# EAGLE schematic Schematic-v1.2 (EAGLE 9.7.0)
DESCRIPTION: Test Description
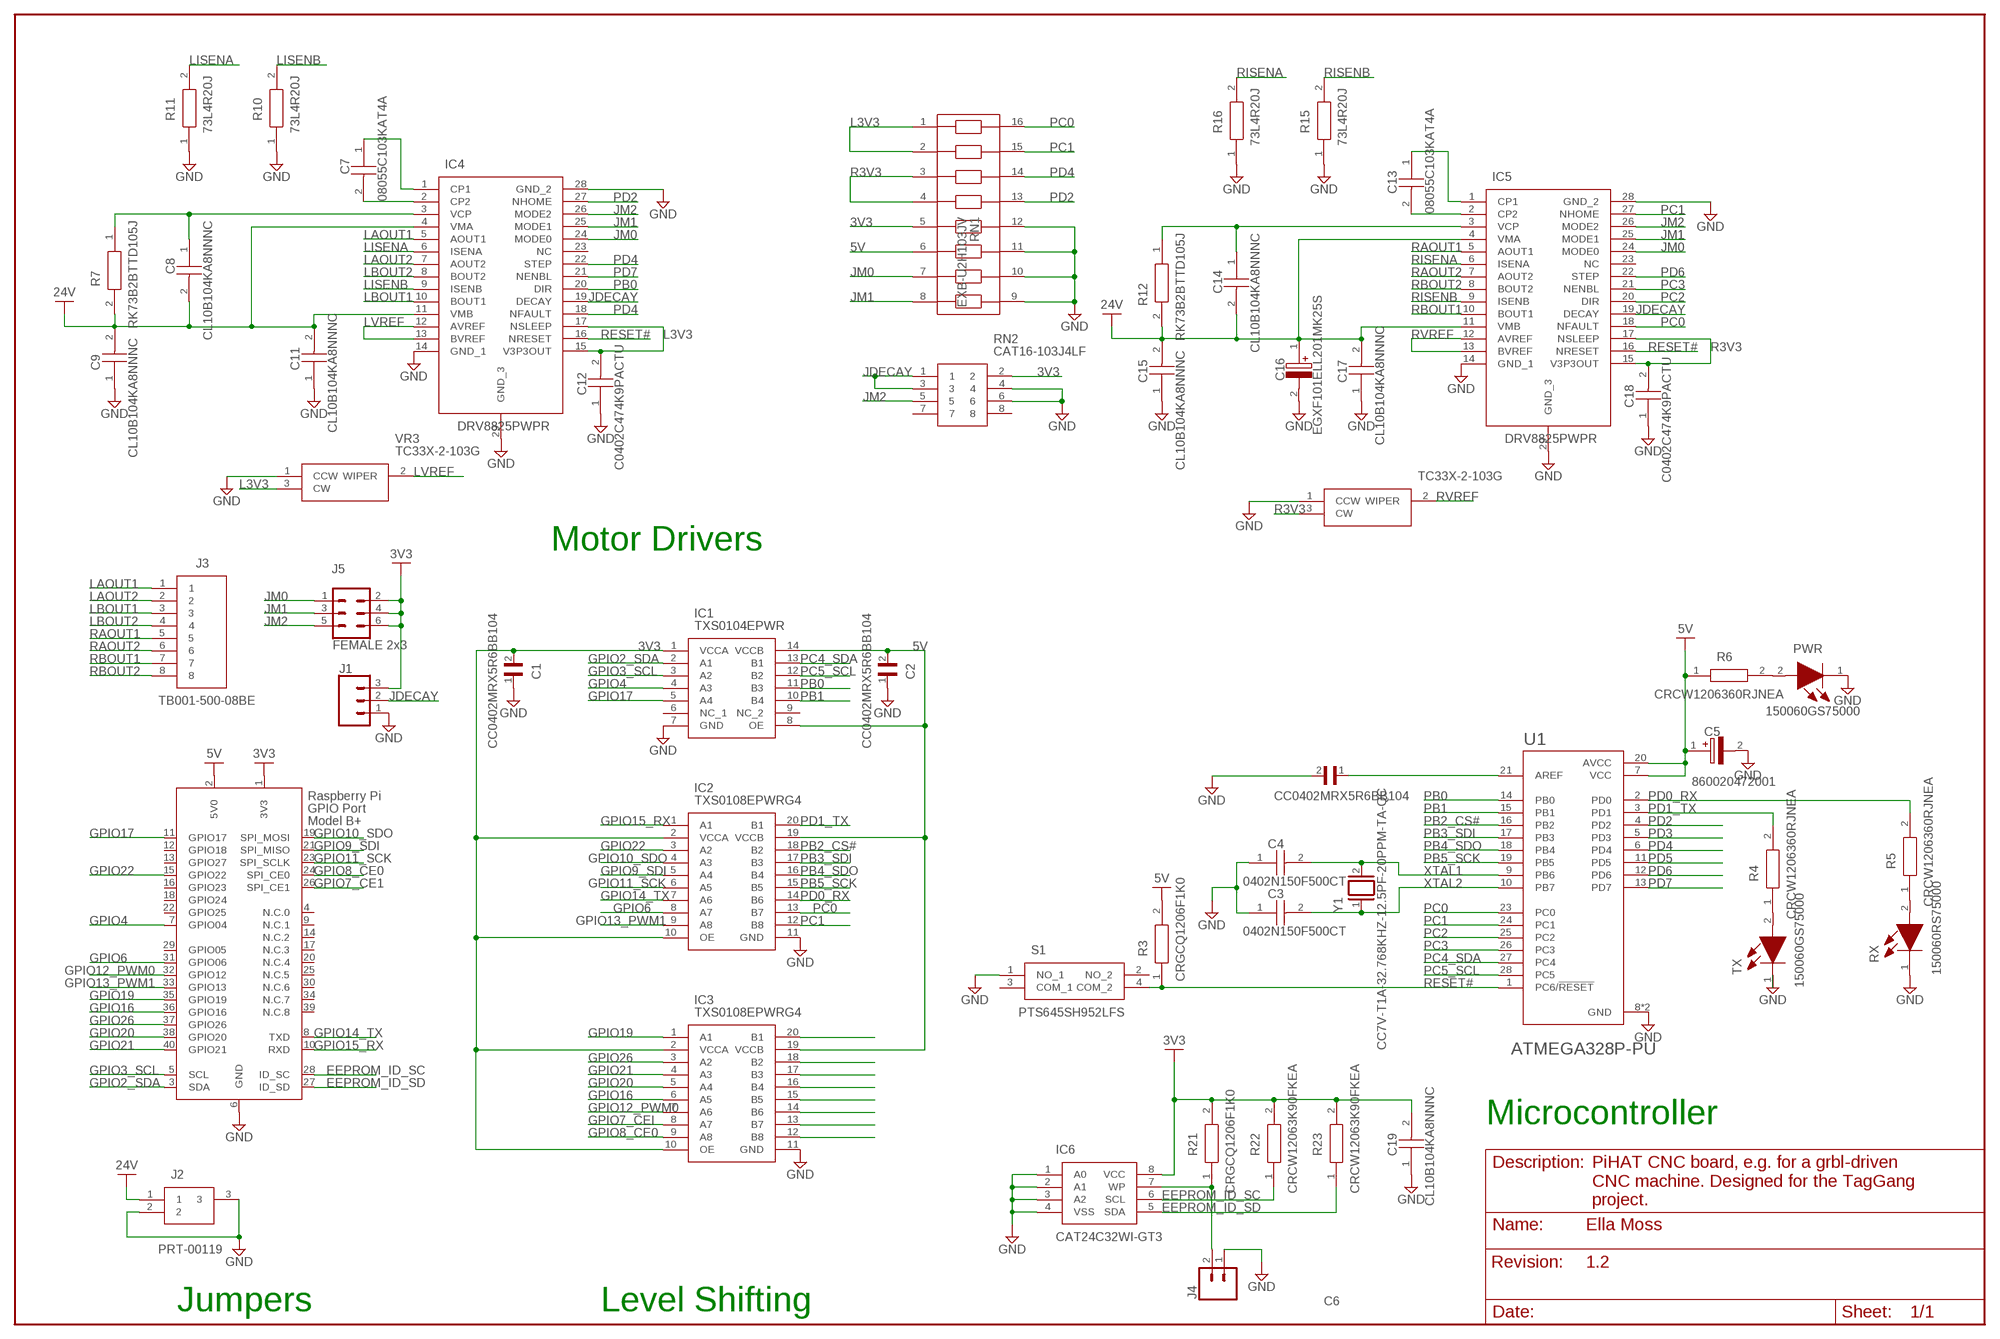
[diagram p0: schematic, sheet 1]

## Parts
C1  CC0402MRX5R6BB104  [CAPC1005X55N]
C2  CC0402MRX5R6BB104  [CAPC1005X55N]
C3  0402N150F500CT  [CAPC1005X55N]
C4  0402N150F500CT  [CAPC1005X55N]
C5  860020472001  [CAPPRD200W52D500H1250]
C6  CC0402MRX5R6BB104  [CAPC1005X55N]
C7  08055C103KAT4A  [CAPC2012X94N]
C8  CL10B104KA8NNNC  [CAPC1608X90N]
C9  CL10B104KA8NNNC  [CAPC1608X90N]
C11  CL10B104KA8NNNC  [CAPC1608X90N]
C12  C0402C474K9PACTU  [CAPC1005X55N]
C13  08055C103KAT4A  [CAPC2012X94N]
C14  CL10B104KA8NNNC  [CAPC1608X90N]
C15  CL10B104KA8NNNC  [CAPC1608X90N]
C16  EGXF101ELL201MK25S  [CAPPRD500W60D1275H2650]
C17  CL10B104KA8NNNC  [CAPC1608X90N]
C18  C0402C474K9PACTU  [CAPC1005X55N]
C19  CL10B104KA8NNNC  [CAPC1608X90N]
IC1  TXS0104EPWR  [SOP65P640X120-14N]
IC2  TXS0108EPWRG4  [SOP65P640X120-20N]
IC3  TXS0108EPWRG4  [SOP65P640X120-20N]
IC4  DRV8825PWPR  [SOP65P640X120-29N]
IC5  DRV8825PWPR  [SOP65P640X120-29N]
IC6  CAT24C32WI-GT3  [SOIC127P600X175-8N]
J1  CONN_03  [1X03]
J2  PRT-00119  [PRT00119]
J3  TB001-500-08BE  [TB00150008BE]
J4  CONN_02  [1X02]
J5  FEMALE 2x3  CONN_03X2FEMALE  [2X3]
PWR  150060GS75000  [LEDC1608X80N]
R3  CRGCQ1206F1K0  [RESC3116X65N]
R4  CRCW1206360RJNEA  [RESC3216X60N]
R5  CRCW1206360RJNEA  [RESC3216X60N]
R6  CRCW1206360RJNEA  [RESC3216X60N]
R7  RK73B2BTTD105J  [RESC3216X70N]
R10  73L4R20J  [RESC3216X70N]
R11  73L4R20J  [RESC3216X70N]
R12  RK73B2BTTD105J  [RESC3216X70N]
R15  73L4R20J  [RESC3216X70N]
R16  73L4R20J  [RESC3216X70N]
R21  CRGCQ1206F1K0  [RESC3116X65N]
R22  CRCW12063K90FKEA  [RESC3216X60N]
R23  CRCW12063K90FKEA  [RESC3216X60N]
RN1  EXB-U2H103JV  [EXBU2H]
RN2  CAT16-103J4LF  [CAPCAV80P155X320X60-8L]
RX  150060RS75000  [LEDC1608X80N]
S1  PTS645SH952LFS  [PTS645SH952LFS]
TX  150060GS75000  [LEDC1608X80N]
U1  ATMEGA328P-PU  [DIP794W46P254L2967H457Q28B]
VR3  TC33X-2-103G  [TC33X2503E]
VR4  TC33X-2-103G  [TC33X2503E]
X1  RASPI_BOARD_B+_HD  [RASPI_BOARD_B+HAT_DF]
Y1  CC7V-T1A-32.768KHZ-12.5PF-20PPM-TA-QC  [XTAL_CC7V-T1A-32.768KHZ-12.5PF-20PPM-TA-QC]

## Nets
3V3: C1.2 C19.2 IC1.1(VCCA) IC2.2(VCCA) IC2.10(OE) IC3.2(VCCA) IC3.10(OE) IC6.8(VCC) J1.3 J5.2 J5.4 J5.6 R21.2 R22.2 R23.2 RN1.5 RN2.2 X1.1(3V3)
5V: C2.2 C5.1(+) IC1.8(OE) IC1.14(VCCB) IC2.19(VCCB) IC3.19(VCCB) R3.2 R6.1 RN1.6 U1.7(VCC) U1.20(AVCC) X1.2(5V0)
24V: C8.2 C9.2 C11.2 C14.2 C15.2 C16.1(+) C17.2 IC4.4(VMA) IC4.11(VMB) IC5.4(VMA) IC5.11(VMB) J2.1 R7.2 R12.2
EEPROM_ID_SC: IC6.6(SCL) R22.1 X1.28(ID_SC)
EEPROM_ID_SD: IC6.5(SDA) R23.1 X1.27(ID_SD)
GND: C1.1 C2.1 C3.1 C4.1 C5.2(-) C6.2 C9.1 C11.1 C12.1 C15.1 C16.2(-) C17.1 C18.1 C19.1 IC1.7(GND) IC2.11(GND) IC3.11(GND) IC4.14(GND_1) IC4.28(GND_2) IC4.29(GND_3) IC5.14(GND_1) IC5.28(GND_2) IC5.29(GND_3) IC6.1(A0) IC6.2(A1) IC6.3(A2) IC6.4(VSS) J1.1 J2.2 J2.3 J4.1 PWR.1(K) R10.1 R11.1 R15.1 R16.1 RN1.9 RN1.10 RN1.11 RN1.12 RN2.4 RN2.6 RX.1(K) S1.1(NO_1) TX.1(K) U1.8(GND) U1.22(GND) VR3.1(CCW) VR4.1(CCW) X1.6(GND)
GPIO2_SDA: IC1.2(A1) X1.3(SDA)
GPIO3_SCL: IC1.3(A2) X1.5(SCL)
GPIO4: IC1.4(A3) X1.7(GPIO04)
GPIO6: IC2.8(A7) X1.31(GPIO06)
GPIO7_CE1: X1.26(SPI_CE1)
GPIO7_CEI: IC3.8(A7)
GPIO8_CE0: IC3.9(A8) X1.24(SPI_CE0)
GPIO9_SDI: IC2.5(A4) X1.21(SPI_MISO)
GPIO10_SDO: IC2.4(A3) X1.19(SPI_MOSI)
GPIO11_SCK: IC2.6(A5) X1.23(SPI_SCLK)
GPIO12_PWM0: IC3.7(A6) X1.32(GPIO12)
GPIO13_PWM1: IC2.9(A8) X1.33(GPIO13)
GPIO14_TX: IC2.7(A6) X1.8(TXD)
GPIO15_RX: IC2.1(A1) X1.10(RXD)
GPIO16: IC3.6(A5) X1.36(GPIO16)
GPIO17: IC1.5(A4) X1.11(GPIO17)
GPIO19: IC3.1(A1) X1.35(GPIO19)
GPIO20: IC3.5(A4) X1.38(GPIO20)
GPIO21: IC3.4(A3) X1.40(GPIO21)
GPIO22: IC2.3(A2) X1.15(GPIO22)
GPIO26: IC3.3(A2) X1.37(GPIO26)
JDECAY: IC4.19(DECAY) IC5.19(DECAY) J1.2 RN2.1 RN2.3
JM0: IC4.24(MODE0) IC5.24(MODE0) J5.1 RN1.7
JM1: IC4.25(MODE1) IC5.25(MODE1) J5.3 RN1.8
JM2: IC4.26(MODE2) IC5.26(MODE2) J5.5 RN2.5
L3V3: C12.2 IC4.15(V3P3OUT) IC4.17(NSLEEP) RN1.1 RN1.2 VR3.3(CW)
LAOUT1: IC4.5(AOUT1) J3.1
LAOUT2: IC4.7(AOUT2) J3.2
LBOUT1: IC4.10(BOUT1) J3.3
LBOUT2: IC4.8(BOUT2) J3.4
LISENA: IC4.6(ISENA) R11.2
LISENB: IC4.9(ISENB) R10.2
LVREF: IC4.12(AVREF) IC4.13(BVREF) VR3.2(WIPER)
N$1: C13.1 IC5.1(CP1)
N$2: R5.1 RX.2(A)
N$3: PWR.2(A) R6.2
N$4: C6.1 U1.21(AREF)
N$5: C7.1 IC4.1(CP1)
N$6: C7.2 IC4.2(CP2)
N$7: C13.2 IC5.2(CP2)
N$8: C8.1 IC4.3(VCP) R7.1
N$9: C14.1 IC5.3(VCP) R12.1
N$10: R4.1 TX.2(A)
N$11: IC6.7(WP) J4.2 R21.1
N$12: IC3.12(B8)
N$13: IC3.13(B7)
N$14: IC3.14(B6)
N$15: IC3.15(B5)
N$16: IC3.16(B4)
N$17: IC3.17(B3)
N$18: IC3.18(B2)
N$19: IC3.20(B1)
PB0: IC1.11(B3) IC4.20(DIR) U1.14(PB0)
PB1: IC1.10(B4) U1.15(PB1)
PB2_CS#: IC2.18(B2) U1.16(PB2)
PB3_SDI: IC2.17(B3) U1.17(PB3)
PB4_SDO: IC2.16(B4) U1.18(PB4)
PB5_SCK: IC2.15(B5) U1.19(PB5)
PC0: IC2.13(B7) IC5.18(NFAULT) RN1.16 U1.23(PC0)
PC1: IC2.12(B8) IC5.27(NHOME) RN1.15 U1.24(PC1)
PC2: IC5.20(DIR) U1.25(PC2)
PC3: IC5.21(NENBL) U1.26(PC3)
PC4_SDA: IC1.13(B1) U1.27(PC4)
PC5_SCL: IC1.12(B2) U1.28(PC5)
PD0_RX: IC2.14(B6) R5.2 U1.2(PD0)
PD1_TX: IC2.20(B1) R4.2 U1.3(PD1)
PD2: IC4.27(NHOME) RN1.13 U1.4(PD2)
PD3: U1.5(PD3)
PD4: IC4.18(NFAULT) IC4.22(STEP) RN1.14 U1.6(PD4)
PD5: U1.11(PD5)
PD6: IC5.22(STEP) U1.12(PD6)
PD7: IC4.21(NENBL) U1.13(PD7)
R3V3: C18.2 IC5.15(V3P3OUT) IC5.17(NSLEEP) RN1.3 RN1.4 VR4.3(CW)
RAOUT1: IC5.5(AOUT1) J3.5
RAOUT2: IC5.7(AOUT2) J3.6
RBOUT1: IC5.10(BOUT1) J3.7
RBOUT2: IC5.8(BOUT2) J3.8
RESET#: IC4.16(NRESET) IC5.16(NRESET) R3.1 S1.4(COM_2) U1.1(PC6/!RESET)
RISENA: IC5.6(ISENA) R16.2
RISENB: IC5.9(ISENB) R15.2
RVREF: IC5.12(AVREF) IC5.13(BVREF) VR4.2(WIPER)
XTAL1: C4.2 U1.9(PB6) Y1.2
XTAL2: C3.2 U1.10(PB7) Y1.1
Unconnected: IC1.6(NC_1) IC1.9(NC_2) IC4.23(NC) IC5.23(NC) RN2.7 RN2.8 S1.2(NO_2) S1.3(COM_1) X1.4(N.C.0) X1.9(N.C.1) X1.12(GPIO18) X1.13(GPIO27) X1.14(N.C.2) X1.16(GPIO23) X1.17(N.C.3) X1.18(GPIO24) X1.20(N.C.4) X1.22(GPIO25) X1.25(N.C.5) X1.29(GPIO05) X1.30(N.C.6) X1.34(N.C.7) X1.39(N.C.8)

## Notes on the sheet
- Motor Drivers
- Microcontroller
- Jumpers | Level Shifting

## Library data of the parts
C1 C2 C6 = CC0402MRX5R6BB104:CC0402MRX5R6BB104: CAP CER 0.1UF 10V X5R 0402; DESCRIPTION: 0.1 µF ±20% 10V Ceramic Capacitor X5R 0402 (1005 Metric); DIGIKEY_PART_NUMBER: 311-1731-2-ND; MF: Yageo; MP: CC0402MRX5R6BB104; PACKAGE: 0402 Yageo; PURCHASE-URL: https://pricing.snapeda.com/search?q=CC0402MRX5R6BB104&ref=eda
C3 C4 = 0402N150F500CT:0402N150F500CT: Multilayer Ceramic Capacitors MLCC - SMD/SMT 0402 MLCC NPO 15 pF +/- 1% 50 V T&R GP Source: Datasheet <https://www.mouser.de/datasheet/2/210/WTC_MLCC_General_Purpose-1534899.pdf>; DESCRIPTION: Multilayer Ceramic Capacitors MLCC - SMD/SMT 0402 MLCC NPO 15 pF +/- 1% 50 V T&R GP; HEIGHT: 0.55mm; MANUFACTURER_NAME: Walsin Technology Corporation; MANUFACTURER_PART_NUMBER: 0402N150F500CT
C5 = 860020472001:860020472001: Wurth Elektronik 4.7uF 25 V dc Aluminium Electrolytic Capacitor, WCAP-ATG5 Series 2000h 5 (Dia.) x 11mm Source: Datasheet <https://componentsearchengine.com/Datasheets/2/860020472001.pdf>; DESCRIPTION: Wurth Elektronik 4.7uF 25 V dc Aluminium Electrolytic Capacitor, WCAP-ATG5 Series 2000h 5 (Dia.) x 11mm; HEIGHT: 12.5mm; MANUFACTURER_NAME: Wurth Elektronik; MANUFACTURER_PART_NUMBER: 860020472001; MOUSER_PART_NUMBER: 710-860020472001; MOUSER_PRICE-STOCK: https://www.mouser.co.uk/ProductDetail/Wurth-Elektronik/860020472001?qs=0KOYDY2FL2%2F%252BlYkeK95R6A%3D%3D
C7 C13 = 08055C103KAT4A:08055C103KAT4A: Multilayer Ceramic Capacitors MLCC - SMD/SMT 50V .01uF X7R 0805 10%TOL Source: Datasheet <https://componentsearchengine.com/Datasheets/1/08055C103KAT4A.pdf>; DESCRIPTION: Multilayer Ceramic Capacitors MLCC - SMD/SMT 50V .01uF X7R 0805 10%TOL; HEIGHT: 0.94mm; MANUFACTURER_NAME: AVX; MANUFACTURER_PART_NUMBER: 08055C103KAT4A; MOUSER_PART_NUMBER: 581-08055C103KAT4A; MOUSER_PRICE-STOCK: https://www.mouser.com/Search/Refine.aspx?Keyword=581-08055C103KAT4A
C8 C9 C11 C14 C15 C17 C19 = CL10B104KA8NNNC:CL10B104KA8NNNC: Ceramic cap 0603 X7R 25V 100nF (Reel) Samsung Electro-Mechanics 100nF Multilayer Ceramic Capacitor (MLCC) 25 V +/-10% X7R dielectric CL max op. temp. +125C Source: Datasheet <http://media.digikey.com/pdf/Data Sheets/Samsung PDFs/CL_Series_MLCC_ds.pdf>; DESCRIPTION: Ceramic cap 0603 X7R 25V 100nF (Reel) Samsung Electro-Mechanics 100nF Multilayer Ceramic Capacitor (MLCC) 25 V +/-10% X7R dielectric CL max op. temp. +125C; HEIGHT: 0.9mm; MANUFACTURER_NAME: SAMSUNG; MANUFACTURER_PART_NUMBER: CL10B104KA8NNNC; MOUSER_PART_NUMBER: 187-CL10B104KA8NNNC; MOUSER_PRICE-STOCK: https://www.mouser.co.uk/ProductDetail/Samsung-Electro-Mechanics/CL10B104KA8NNNC?qs=349EhDEZ59rmu3pGeZXx0A%3D%3D
C12 C18 = C0402C474K9PACTU:C0402C474K9PACTU: SMD Comm X5R, Ceramic, 0.47 uF, 10%, 6.3 VDC, 15.75 VDC, 85C, -55C, X5R, SMD, MLCC, Temperature Stable, Class II, 10 % , 1.0638 GOhms, 1.21 mg, 0402, 1mm, 0.5mm, 0.5mm, 0.3mm, 0.3mm, 10000, 78 Weeks, 70 Source: Datasheet <https://content.kemet.com/datasheets/KEM_C1002_X7R_SMD.pdf>; DESCRIPTION: SMD Comm X5R, Ceramic, 0.47 uF, 10%, 6.3 VDC, 15.75 VDC, 85C, -55C, X5R, SMD, MLCC, Temperature Stable, Class II, 10 % , 1.0638 GOhms, 1.21 mg, 0402, 1mm, 0.5mm, 0.5mm, 0.3mm, 0.3mm, 10000, 78 Weeks, 70; HEIGHT: 0.55mm; MANUFACTURER_NAME: KEMET; MANUFACTURER_PART_NUMBER: C0402C474K9PACTU; MOUSER_PART_NUMBER: 80-C0402C474K9P; MOUSER_PRICE-STOCK: https://www.mouser.co.uk/ProductDetail/KEMET/C0402C474K9PACTU?qs=KHg1sw%2FVM5RivoKJ3oVJkQ%3D%3D
C16 = EGXF101ELL201MK25S:EGXF101ELL201MK25S: Aluminum Electrolytic Capacitors - Radial Leaded 200uF 100 Volts 20% Source: Datasheet <https://componentsearchengine.com/Datasheets/2/EGXF101ELL201MK25S.pdf>; DESCRIPTION: Aluminum Electrolytic Capacitors - Radial Leaded 200uF 100 Volts 20%; HEIGHT: 26.5mm; MANUFACTURER_NAME: Chemi-Con; MANUFACTURER_PART_NUMBER: EGXF101ELL201MK25S; MOUSER_PART_NUMBER: 661-EGXF101ELL201MK2; MOUSER_PRICE-STOCK: https://www.mouser.co.uk/ProductDetail/United-Chemi-Con/EGXF101ELL201MK25S?qs=8BXZADTIn4FXlUL9JzZ4Ow%3D%3D
IC1 = TXS0104EPWR:TXS0104EPWR: TXS0104EPWR, Voltage Level Translator, Open Drain 1.65 3.6 V, 2.3 5.5 V 14-Pin TSSOP Source: Datasheet <http://www.ti.com/lit/ds/symlink/txs0104e.pdf>; DESCRIPTION: TXS0104EPWR, Voltage Level Translator, Open Drain 1.65 3.6 V, 2.3 5.5 V 14-Pin TSSOP; HEIGHT: 1.2mm; MANUFACTURER_NAME: Texas Instruments; MANUFACTURER_PART_NUMBER: TXS0104EPWR; MOUSER_PART_NUMBER: 595-TXS0104EPWR; MOUSER_PRICE-STOCK: https://www.mouser.co.uk/ProductDetail/Texas-Instruments/TXS0104EPWR?qs=7kv20MEVUlglsv2MH6ZndA%3D%3D
IC2 IC3 = TXS0108EPWRG4:TXS0108EPWRG4: Translation - Voltage Levels 8B Bidir Vltg-Level Translator Source: Datasheet <https://www.ti.com/lit/ds/symlink/txs0108e.pdf?ts=1617786399489&ref_url=https%3A%2F%2Fyellow-search.com%2F>; DESCRIPTION: Translation - Voltage Levels 8B Bidir Vltg-Level Translator; HEIGHT: 1.2mm; MANUFACTURER_NAME: Texas Instruments; MANUFACTURER_PART_NUMBER: TXS0108EPWRG4; MOUSER_PART_NUMBER: 595-TXS0108EPWRG4; MOUSER_PRICE-STOCK: https://www.mouser.co.uk/ProductDetail/Texas-Instruments/TXS0108EPWRG4?qs=wkx8pu8tL7LKCwSiM1j4%252Bw%3D%3D
IC4 IC5 = DRV8825PWPR:DRV8825PWPR: 2.5A Bipolar Stepper Motor Driver with On-Chip 1/32 Microstepping Indexer (Step/Dir Ctrl) Source: Datasheet <http://www.ti.com/lit/gpn/drv8825>; DESCRIPTION: 2.5A Bipolar Stepper Motor Driver with On-Chip 1/32 Microstepping Indexer (Step/Dir Ctrl); HEIGHT: 1.2mm; MANUFACTURER_NAME: Texas Instruments; MANUFACTURER_PART_NUMBER: DRV8825PWPR; MOUSER_PART_NUMBER: 595-DRV8825PWPR; MOUSER_PRICE-STOCK: https://www.mouser.co.uk/ProductDetail/Texas-Instruments/DRV8825PWPR?qs=L4ss%2FyqpMWRQV%252B0JWK8r%2FQ%3D%3D
IC6 = CAT24C32WI-GT3:CAT24C32WI-GT3: EEPROM Serial-I2C 32K 4Kx8 1.8V/5V SOIC8 CAT24C32WI-GT3, EEPROM Memory 32kbit,, 4096 x, 8bit, Serial-I2C 1.7 5.5 V, 8-Pin SOIC Source: Datasheet <http://www.onsemi.com/pub/Collateral/CAT24C32-D.PDF>; DESCRIPTION: EEPROM Serial-I2C 32K 4Kx8 1.8V/5V SOIC8 CAT24C32WI-GT3, EEPROM Memory 32kbit,, 4096 x, 8bit, Serial-I2C 1.7 5.5 V, 8-Pin SOIC; HEIGHT: 1.75mm; MANUFACTURER_NAME: onsemi; MANUFACTURER_PART_NUMBER: CAT24C32WI-GT3; MOUSER_PART_NUMBER: 698-CAT24C32WI-GT3; MOUSER_PRICE-STOCK: https://www.mouser.co.uk/ProductDetail/onsemi/CAT24C32WI-GT3?qs=rZgeL6XvLwaTa79VuYkKQA%3D%3D
J1 = SparkFun-Connectors:CONN_03: Multi connection point. Often used as Generic Header-pin footprint for 0.1 inch spaced/style header connections On any of the 0.1 inch spaced packages, you can populate with these: Break Away Headers - Straight <https://www.sparkfun.com/products/116> (PRT-00116) Break Away Male Headers - Right Angle <https://www.sparkfun.com/products/553> (PRT-00553) Female Headers <https://www.sparkfun.com/products/115> (PRT-00115) Break Away Headers - Machine Pin <https://www.sparkfun.com/products/117> (PRT-00117) Break Away Female Headers - Swiss Machine Pin <https://www.sparkfun.com/products/743> (PRT-00743) Stackable Header - 3 Pin (Female, 0.1") <https://www.sparkfun.com/products/13875> (PRT-13875) For SCREWTERMINALS and SPRING TERMINALS visit here: Screw Terimnals on SparkFun.com <https://www.sparkfun.com/search/results?term=Screw+Terminals> (5mm/3.5mm/2.54mm spacing) This device is also useful as a general connection point to wire up your design to another part of your project. Our various solder wires solder well into these plated through hole pads. Hook-Up Wire - Assortment (Stranded, 22 AWG) <https://www.sparkfun.com/products/11375> (PRT-11375) Hook-Up Wire - Assortment (Solid Core, 22 AWG) <https://www.sparkfun.com/products/11367> (PRT-11367) View the entire wire category on our website here <https://www.sparkfun.com/categories/141> Special notes: Molex polarized connector foot print use with SKU : PRT-08232 with associated crimp pins and housings.
J2 = PRT-00119:PRT-00119: SparkFun Accessories DC Barrel Power Jack/Connector Source: Datasheet <https://www.sparkfun.com/datasheets/Prototyping/Barrel-Connector-PJ-202A.pdf>; DESCRIPTION: SparkFun Accessories DC Barrel Power Jack/Connector; HEIGHT: 11mm; MANUFACTURER_NAME: SparkFun; MANUFACTURER_PART_NUMBER: PRT-00119; MOUSER_PART_NUMBER: 474-PRT-00119; MOUSER_PRICE-STOCK: https://www.mouser.co.uk/ProductDetail/SparkFun/PRT-00119?qs=WyAARYrbSnbnQpS9xf%252Bx5A%3D%3D
J3 = TB001-500-08BE:TB001-500-08BE: Fixed Terminal Blocks Terminal block, screw type, 5.00 , horizontal, 8 poles, CUI Blue, slotted screw, PCB mount Source: Datasheet <https://datasheet.datasheetarchive.com/originals/distributors/Datasheets_SAMA/b931254781d34eecaec474c4ccd45807.pdf>; DESCRIPTION: Fixed Terminal Blocks Terminal block, screw type, 5.00 , horizontal, 8 poles, CUI Blue, slotted screw, PCB mount; HEIGHT: 12.9mm; MANUFACTURER_NAME: CUI Devices; MANUFACTURER_PART_NUMBER: TB001-500-08BE; MOUSER_PART_NUMBER: 490-TB001-500-08BE; MOUSER_PRICE-STOCK: https://www.mouser.co.uk/ProductDetail/CUI-Devices/TB001-500-08BE?qs=vLWxofP3U2yEuwKNSzgFJw%3D%3D
J4 = SparkFun-Connectors:CONN_02: Multi connection point. Often used as Generic Header-pin footprint for 0.1 inch spaced/style header connections On any of the 0.1 inch spaced packages, you can populate with these: Break Away Headers - Straight <https://www.sparkfun.com/products/116> (PRT-00116) Break Away Male Headers - Right Angle <https://www.sparkfun.com/products/553> (PRT-00553) Female Headers <https://www.sparkfun.com/products/115> (PRT-00115) Break Away Headers - Machine Pin <https://www.sparkfun.com/products/117> (PRT-00117) Break Away Female Headers - Swiss Machine Pin <https://www.sparkfun.com/products/743> (PRT-00743) For SCREWTERMINALS and SPRING TERMINALS visit here: Screw Terimnals on SparkFun.com <https://www.sparkfun.com/search/results?term=Screw+Terminals> (5mm/3.5mm/2.54mm spacing) This device is also useful as a general connection point to wire up your design to another part of your project. Our various solder wires solder well into these plated through hole pads. Hook-Up Wire - Assortment (Stranded, 22 AWG) <https://www.sparkfun.com/products/11375> (PRT-11375) Hook-Up Wire - Assortment (Solid Core, 22 AWG) <https://www.sparkfun.com/products/11367> (PRT-11367) View the entire wire category on our website here <https://www.sparkfun.com/categories/141> Special notes: Molex polarized connector foot print use with: PRT-08233 with associated crimp pins and housings. 2.54_SCREWTERM for use with PRT-10571. 3.5mm Screw Terminal footprints for PRT-08084 5mm Screw Terminal footprints for use with PRT-08432
J5 = SparkFun-Connectors:CONN_03X2: Multi connection point. Often used as Generic Header-pin footprint for 0.1 inch spaced/style header connections You can populate with any combo of single row headers, but if you'd like an exact match, check these: Header - 2x3 (Male, 0.1") <https://www.sparkfun.com/products/12807> (PRT-12807) Header - 2x3 (Female, 0.1") <https://www.sparkfun.com/products/13010> (PRT-13010) 2x3 Pin Shrouded Header <https://www.sparkfun.com/products/10877> (PRT-10877) On any of the 0.1 inch spaced packages, you can populate with these: Break Away Headers - Straight <https://www.sparkfun.com/products/116> (PRT-00116) Break Away Male Headers - Right Angle <https://www.sparkfun.com/products/553> (PRT-00553) Female Headers <https://www.sparkfun.com/products/115> (PRT-00115) Break Away Headers - Machine Pin <https://www.sparkfun.com/products/117> (PRT-00117) Break Away Female Headers - Swiss Machine Pin <https://www.sparkfun.com/products/743> (PRT-00743) Special note: the shrouded connector mates well with our 3x2 ribbon cables: Ribbon Crimp Connector - 6-pin (2x3, Female) <https://www.sparkfun.com/products/10651> (PRT-10651) Ribbon Cable - 6 wire (15ft) <https://www.sparkfun.com/products/10646> (PRT-10646); PROD_ID: CONN-11566
PWR TX = 150060GS75000:150060GS75000: Wurth Elektronik WL-SMCW 520 nm Green LED, 1608 (0603) Clear SMD package Source: Datasheet <https://componentsearchengine.com/Datasheets/2/150060GS75000.pdf>; DESCRIPTION: Wurth Elektronik WL-SMCW 520 nm Green LED, 1608 (0603) Clear SMD package; HEIGHT: 0.8mm; MANUFACTURER_NAME: Wurth Elektronik; MANUFACTURER_PART_NUMBER: 150060GS75000; MOUSER_PART_NUMBER: 710-150060GS75000; MOUSER_PRICE-STOCK: https://www.mouser.co.uk/ProductDetail/Wurth-Elektronik/150060GS75000?qs=LlUlMxKIyB0UYkq5lDO8nA%3D%3D
R3 R21 = CRGCQ1206F1K0:CRGCQ1206F1K0: SMD AEC-Q200 Compliant Thick Film Chip Resistor, Source: Datasheet <https://www.arrow.com/en/products/crgcq1206f1k0/te-connectivity>; DESCRIPTION: SMD AEC-Q200 Compliant Thick Film Chip Resistor,; HEIGHT: 0.65mm; MANUFACTURER_NAME: TE Connectivity; MANUFACTURER_PART_NUMBER: CRGCQ1206F1K0; MOUSER_PART_NUMBER: 279-CRGCQ1206F1K0; MOUSER_PRICE-STOCK: https://www.mouser.co.uk/ProductDetail/TE-Connectivity-Holsworthy/CRGCQ1206F1K0?qs=wUXugUrL1qxm2LgdVtGvlQ%3D%3D
R4-R6 = CRCW1206360RJNEA:CRCW1206360RJNEA: Thick Film Resistors - SMD 1/4watt 360ohms 5% Source: Datasheet <http://componentsearchengine.com/Datasheets/1/CRCW1206360RJNEA.pdf>; DESCRIPTION: Thick Film Resistors - SMD 1/4watt 360ohms 5%; HEIGHT: 0.6mm; MANUFACTURER_NAME: Vishay; MANUFACTURER_PART_NUMBER: CRCW1206360RJNEA; MOUSER_PART_NUMBER: 71-CRCW1206J-360-E3; MOUSER_PRICE-STOCK: https://www.mouser.co.uk/ProductDetail/Vishay-Dale/CRCW1206360RJNEA?qs=f6iYHOF0qgQa5fU%252BdQhP8Q%3D%3D
R7 R12 = RK73B2BTTD105J:RK73B2BTTD105J: Thick Film Resistors - SMD 1/4watts 1Mohms 5% Source: Datasheet <https://www.mouser.in/datasheet/2/219/RK73B-1825463.pdf>; DESCRIPTION: Thick Film Resistors - SMD 1/4watts 1Mohms 5%; HEIGHT: 0.7mm; MANUFACTURER_NAME: KOA Speer; MANUFACTURER_PART_NUMBER: RK73B2BTTD105J
R10 R11 R15 R16 = 73L4R20J:73L4R20J: Current Sense Resistors - SMD 0.2ohms 5% Source: Datasheet <https://datasheet.datasheetarchive.com/originals/distributors/DKDS-12/235821.pdf>; DESCRIPTION: Current Sense Resistors - SMD 0.2ohms 5%; HEIGHT: 0.7mm; MANUFACTURER_NAME: CTS; MANUFACTURER_PART_NUMBER: 73L4R20J; MOUSER_PART_NUMBER: 774-73L4R20J; MOUSER_PRICE-STOCK: https://www.mouser.co.uk/ProductDetail/CTS-Electronic-Components/73L4R20J?qs=hbgUSdfWRJU6l%2FyD8DKbaA%3D%3D
R22 R23 = CRCW12063K90FKEA:CRCW12063K90FKEA: CRCW1206 Resistor T/R 0.25W,1%,3K9 Vishay CRCW Series Thick Film Surface Mount Resistor 1206 Case 3.9k +/-1% 0.25W +/-100ppm/C Source: Datasheet <http://www.vishay.com/docs/20035/dcrcwe3.pdf>; DESCRIPTION: CRCW1206 Resistor T/R 0.25W,1%,3K9 Vishay CRCW Series Thick Film Surface Mount Resistor 1206 Case 3.9k +/-1% 0.25W +/-100ppm/C; HEIGHT: 0.6mm; MANUFACTURER_NAME: Vishay; MANUFACTURER_PART_NUMBER: CRCW12063K90FKEA; MOUSER_PART_NUMBER: 71-CRCW1206-3.9K-E3; MOUSER_PRICE-STOCK: https://www.mouser.co.uk/ProductDetail/Vishay-Dale/CRCW12063K90FKEA?qs=cIcnZvs8mCNkQ0vWXL23Cw%3D%3D
RN1 = EXB-U2H103JV:EXB-U2H103JV: Series/Type: Anti-Sulfurated Chip Resistor Array, Power Rating (W): 0.063, Chip Size (LxW) (mm): 3.8 X 1.6, Resistance Values (): 10000, Resistance Tolerance (%): 5, Terminal Pitch (mm): 0.5, Type of Circuit: Isolated Circuit, Number of Elements (piece): 8, T.C.R (10/K): +/-200, Number of Terminals (piece): 16 Source: Datasheet <https://industrial.panasonic.com/cdbs/www-data/pdf/AOC0000/AOC0000C20.pdf>; DESCRIPTION: Series/Type: Anti-Sulfurated Chip Resistor Array, Power Rating (W): 0.063, Chip Size (LxW) (mm): 3.8 X 1.6, Resistance Values (): 10000, Resistance Tolerance (%): 5, Terminal Pitch (mm): 0.5, Type of Circuit: Isolated Circuit, Number of Elements (piece): 8, T.C.R (10/K): +/-200, Number of Terminals (piece): 16; HEIGHT: 0.55mm; MANUFACTURER_NAME: Panasonic; MANUFACTURER_PART_NUMBER: EXB-U2H103JV; MOUSER_PART_NUMBER: 667-EXB-U2H103JV; MOUSER_PRICE-STOCK: https://www.mouser.co.uk/ProductDetail/Panasonic/EXB-U2H103JV?qs=Z3CaLxJiOJJ7jC1v10U%2Fjw%3D%3D
RN2 = CAT16-103J4LF:CAT16-103J4LF: 4-array concave 1206 LF resistor,10K Bourns CAT16 Series 10k 5% Isolated SMT Resistor Array, 4 Resistors, 0.25W total 1206 Package Source: Datasheet <http://www.bourns.com/docs/Product-Datasheets/cat16-j.pdf>; DESCRIPTION: 4-array concave 1206 LF resistor,10K Bourns CAT16 Series 10k 5% Isolated SMT Resistor Array, 4 Resistors, 0.25W total 1206 Package; HEIGHT: 0.6mm; MANUFACTURER_NAME: Bourns; MANUFACTURER_PART_NUMBER: CAT16-103J4LF; MOUSER_PART_NUMBER: 652-CAT16-103J4LF; MOUSER_PRICE-STOCK: https://www.mouser.co.uk/ProductDetail/Bourns/CAT16-103J4LF?qs=yksRZAkH7gsi20GVw368rQ%3D%3D
RX = 150060RS75000:150060RS75000: WURTH ELEKTRONIK - 150060RS75000 - LED, 0603, RED, 250MCD, 625NM Source: Datasheet <http://katalog.we-online.de/led/datasheet/150060RS75000.pdf>; DESCRIPTION: WURTH ELEKTRONIK - 150060RS75000 - LED, 0603, RED, 250MCD, 625NM; HEIGHT: 0.8mm; MANUFACTURER_NAME: Wurth Elektronik; MANUFACTURER_PART_NUMBER: 150060RS75000; MOUSER_PART_NUMBER: 710-150060RS75000; MOUSER_PRICE-STOCK: https://www.mouser.co.uk/ProductDetail/Wurth-Elektronik/150060RS75000?qs=LlUlMxKIyB3QnmZ3fw%2FVCA%3D%3D
S1 = PTS645SH952LFS:PTS645SH952LFS: SWITCH TACTILE SPST-NO 0.05A 12V Source: Datasheet <https://www.ckswitches.com/media/1471/pts645.pdf>; DESCRIPTION: SWITCH TACTILE SPST-NO 0.05A 12V; HEIGHT: 4.4mm; MANUFACTURER_NAME: C & K COMPONENTS; MANUFACTURER_PART_NUMBER: PTS645SH952LFS; MOUSER_PART_NUMBER: 611-PTS645SH952; MOUSER_PRICE-STOCK: https://www.mouser.co.uk/ProductDetail/CK/PTS645SH952LFS?qs=FQH5YrIbzh%252B2bZJSGdqIFg%3D%3D
U1 = ATMEGA328P-PU:ATMEGA328P-PU: ATmega Series 20 MHz 32 KB Flash 2 KB SRAM 8-Bit Microcontroller - DIP-28; MANUFACTURER: Atmel
VR3 VR4 = TC33X-2-103G:TC33X-2-103G: Trimmer Resistors - SMD 3MM 10KOHMS 25% 0.1WATT OPEN FRM Source: Datasheet <https://www.bourns.com/pdfs/TC33.pdf>; DESCRIPTION: Trimmer Resistors - SMD 3MM 10KOHMS 25% 0.1WATT OPEN FRM; HEIGHT: 1.2mm; MANUFACTURER_NAME: Bourns; MANUFACTURER_PART_NUMBER: TC33X-2-103G; MOUSER_PART_NUMBER: 652-TC33X-2-103G; MOUSER_PRICE-STOCK: https://www.mouser.co.uk/ProductDetail/Bourns/TC33X-2-103G?qs=fmZCN1JtwVGHgHrSUcsPzA%3D%3D
X1 = raspberrypi_bastelstube_v13:RASPI_BOARD_B+: Raspberry Pi GPIO connector with markings for the outer dimensions of the Raspberry Pi board model B+ with different sets of drill holes or mounting pads
Y1 = CC7V-T1A-32.768KHZ-12.5PF-20PPM-TA-QC:CC7V-T1A-32.768KHZ-12.5PF-20PPM-TA-QC: Check availability <https://pricing.snapeda.com/parts/CC7V-T1A-32.768kHz-12.5pF-20PPM-TA-QC/Micro%20Crystal/view-part?ref=eda>; AVAILABILITY: In Stock; DESCRIPTION: LOW FREQUENCY CRYSTAL; MF: Micro Crystal; MP: CC7V-T1A-32.768kHz-12.5pF-20PPM-TA-QC; PACKAGE: SMD-2 Micro Crystal; PRICE: None; PURCHASE-URL: https://pricing.snapeda.com/search?q=CC7V-T1A-32.768kHz-12.5pF-20PPM-TA-QC&ref=eda